# EAGLE design Switch-LIN-SIL-1 (EAGLE 6.5.0)
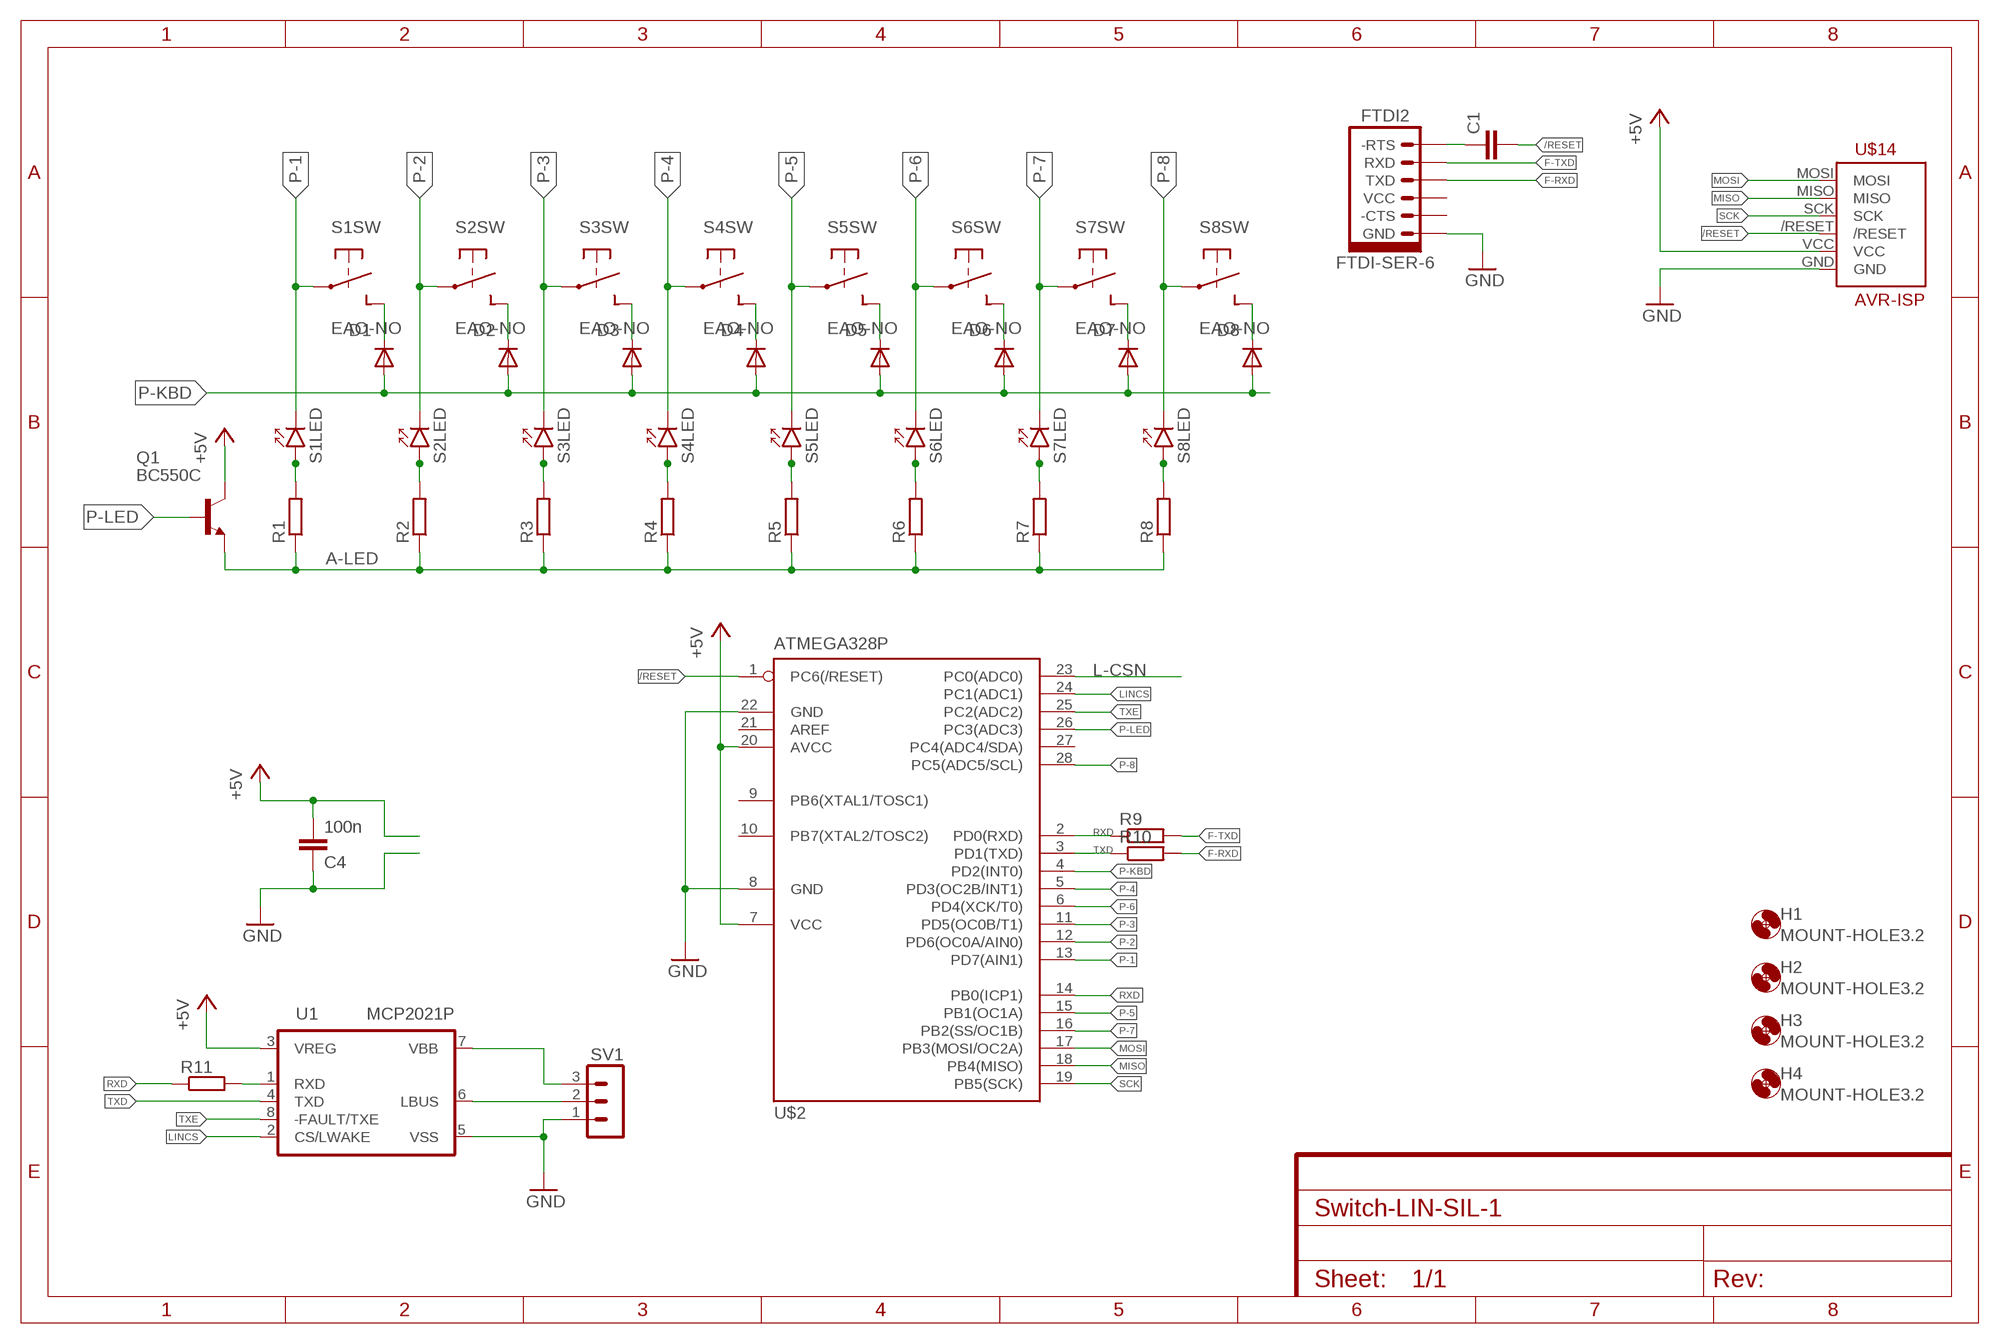
[diagram p0: schematic, sheet 1]

## Parts
C1  C-EU025-025X050  [C025-025X050]
C4  100n  C-EUC0805  [C0805]
D1  1N4148  1N4148DO35-7  [DO35-7]
D2  1N4148  1N4148DO35-7  [DO35-7]
D3  1N4148  1N4148DO35-7  [DO35-7]
D4  1N4148  1N4148DO35-7  [DO35-7]
D5  1N4148  1N4148DO35-7  [DO35-7]
D6  1N4148  1N4148DO35-7  [DO35-7]
D7  1N4148  1N4148DO35-7  [DO35-7]
D8  1N4148  1N4148DO35-7  [DO35-7]
FTDI2  FTDI-SER-6  [FTDI-SER-6]
H1  MOUNT-HOLE3.2  [3,2]
H2  MOUNT-HOLE3.2  [3,2]
H3  MOUNT-HOLE3.2  [3,2]
H4  MOUNT-HOLE3.2  [3,2]
Q1  BC550C  [TO92-EBC]
R1  R-EU_0207/7  [0207/7]
R2  R-EU_0207/7  [0207/7]
R3  R-EU_0207/7  [0207/7]
R4  R-EU_0207/7  [0207/7]
R5  R-EU_0207/7  [0207/7]
R6  R-EU_0207/7  [0207/7]
R7  R-EU_0207/7  [0207/7]
R8  R-EU_0207/7  [0207/7]
R9  R-EU_0207/7  [0207/7]
R10  R-EU_0207/7  [0207/7]
R11  R-EU_0207/7  [0207/7]
S1  EAO-NO  [MA04-1]
S2  EAO-NO  [MA04-1]
S3  EAO-NO  [MA04-1]
S4  EAO-NO  [MA04-1]
S5  EAO-NO  [MA04-1]
S6  EAO-NO  [MA04-1]
S7  EAO-NO  [MA04-1]
S8  EAO-NO  [MA04-1]
SV1  MA03-1  [MA03-1]
U1  MCP2021P  [DIL8]
U$2  ATMEGA328P  [DIL28-3]
U$14  AVR-ISP  [AVR-ISP-SIL]

## Nets
+5V [power]: C4.2 Q1.C U1.3(VREG) U$2.7(VCC) U$2.20(AVCC) U$14.VCC
/RESET: C1.2 U$2.1(PC6(/RESET)) U$14./RESET
A-LED [power]: Q1.E R1.1 R2.1 R3.1 R4.1 R5.1 R6.1 R7.1 R8.1
F-RTS: C1.1 FTDI2.-RTS
F-RXD: FTDI2.TXD R10.2
F-TXD: FTDI2.RXD R9.2
GND [power]: C4.1 FTDI2.GND SV1.1 U1.5(VSS) U$2.8(GND) U$2.22(GND) U$14.GND
L-CSN: U$2.23(PC0(ADC0))
L-RXD: R11.2 U1.1(RXD)
LBUS [l-bus]: SV1.2 U1.6(LBUS)
LINCS: U1.2(CS/LWAKE) U$2.24(PC1(ADC1))
MISO: U$2.18(PB4(MISO)) U$14.MISO
MOSI: U$2.17(PB3(MOSI/OC2A)) U$14.MOSI
N$1: D1.C S1.4(SW:NO2)
N$2: D2.C S2.4(SW:NO2)
N$3: D3.C S3.4(SW:NO2)
N$4: D4.C S4.4(SW:NO2)
N$5: D5.C S5.4(SW:NO2)
N$6: D6.C S6.4(SW:NO2)
N$7: D7.C S7.4(SW:NO2)
N$8: D8.C S8.4(SW:NO2)
N$9: R1.2 S1.2(LED:A)
N$10: R2.2 S2.2(LED:A)
N$11: R3.2 S3.2(LED:A)
N$12: R4.2 S4.2(LED:A)
N$13: R5.2 S5.2(LED:A)
N$14: R6.2 S6.2(LED:A)
N$15: R7.2 S7.2(LED:A)
N$16: R8.2 S8.2(LED:A)
P-1: S1.1(LED:C) S1.3(SW:NO1) U$2.13(PD7(AIN1))
P-2: S2.1(LED:C) S2.3(SW:NO1) U$2.12(PD6(OC0A/AIN0))
P-3: S3.1(LED:C) S3.3(SW:NO1) U$2.11(PD5(OC0B/T1))
P-4: S4.1(LED:C) S4.3(SW:NO1) U$2.5(PD3(OC2B/INT1))
P-5: S5.1(LED:C) S5.3(SW:NO1) U$2.15(PB1(OC1A))
P-6: S6.1(LED:C) S6.3(SW:NO1) U$2.6(PD4(XCK/T0))
P-7: S7.1(LED:C) S7.3(SW:NO1) U$2.16(PB2(SS/OC1B))
P-8: S8.1(LED:C) S8.3(SW:NO1) U$2.28(PC5(ADC5/SCL))
P-KBD: D1.A D2.A D3.A D4.A D5.A D6.A D7.A D8.A U$2.4(PD2(INT0))
P-LED: Q1.B U$2.26(PC3(ADC3))
RXD: R9.1 R11.1 U$2.2(PD0(RXD)) U$2.14(PB0(ICP1))
SCK: U$2.19(PB5(SCK)) U$14.SCK
TXD: R10.1 U1.4(TXD) U$2.3(PD1(TXD))
TXE: U1.8(-FAULT/TXE) U$2.25(PC2(ADC2))
VBB [l-bus]: SV1.3 U1.7(VBB)
Unconnected: FTDI2.-CTS FTDI2.VCC U$2.9(PB6(XTAL1/TOSC1)) U$2.10(PB7(XTAL2/TOSC2)) U$2.21(AREF) U$2.27(PC4(ADC4/SDA))

## Library data of the parts
C1 C4 = rcl:C-EU: CAPACITOR, European symbol
D1-D8 = diode:1N4148: DIODE high speed (Philips)
FTDI2 = alo:FTDI-SER-6: FTDI serial cable header: http://www.ftdichip.com/Products/Cables/USBTTLSerial.htm Models TTL-232R-3V3 and TTL-232R-5V
H1-H4 = holes:MOUNT-HOLE: MOUNTING HOLE with drill center marker
Q1 = transistor-npn:BC550*: NPN Transistor
R1-R11 = rcl:R-EU_: RESISTOR, European symbol
S1-S8 = alo:EAO-NO
SV1 = con-lstb:MA03-1: PIN HEADER; OC_FARNELL: unknown; OC_NEWARK: unknown
U1 = alo:MCP2021
U$2 = alo:ATMEGA328P
U$14 = alo:AVR-ISP

## Net classes
0 default: width 0.305 mm, drill 0.305 mm, clearance 0.152 mm
1 power: width 0.61 mm, drill 0.61 mm, clearance 0.152 mm
2 l-bus: width 0.61 mm, drill 0.61 mm, clearance 0.61 mm

## Board
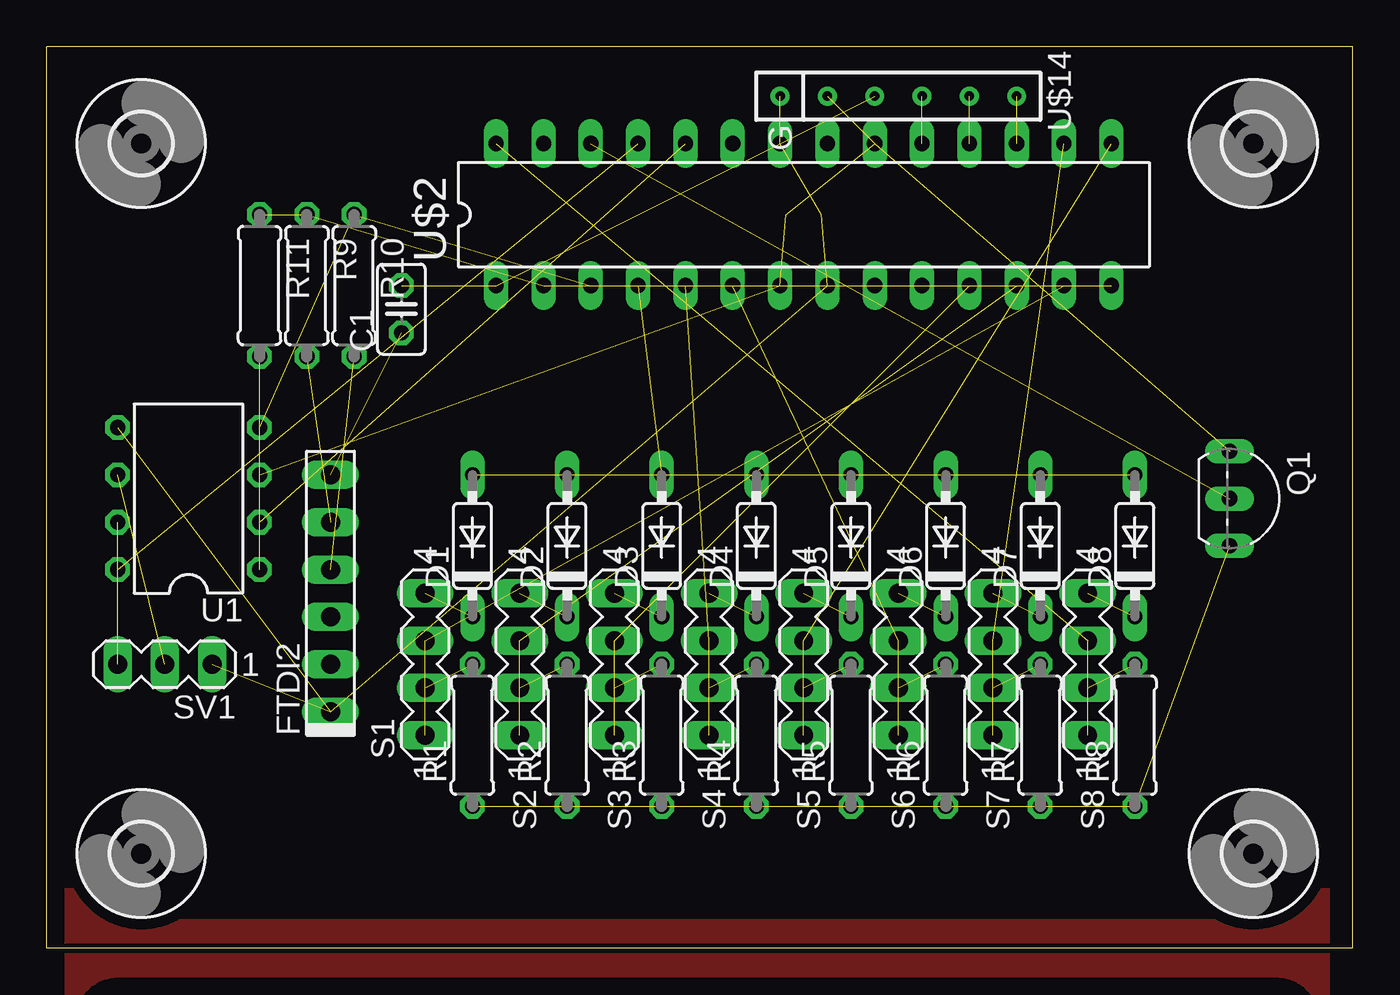
[diagram p1: board, top side]
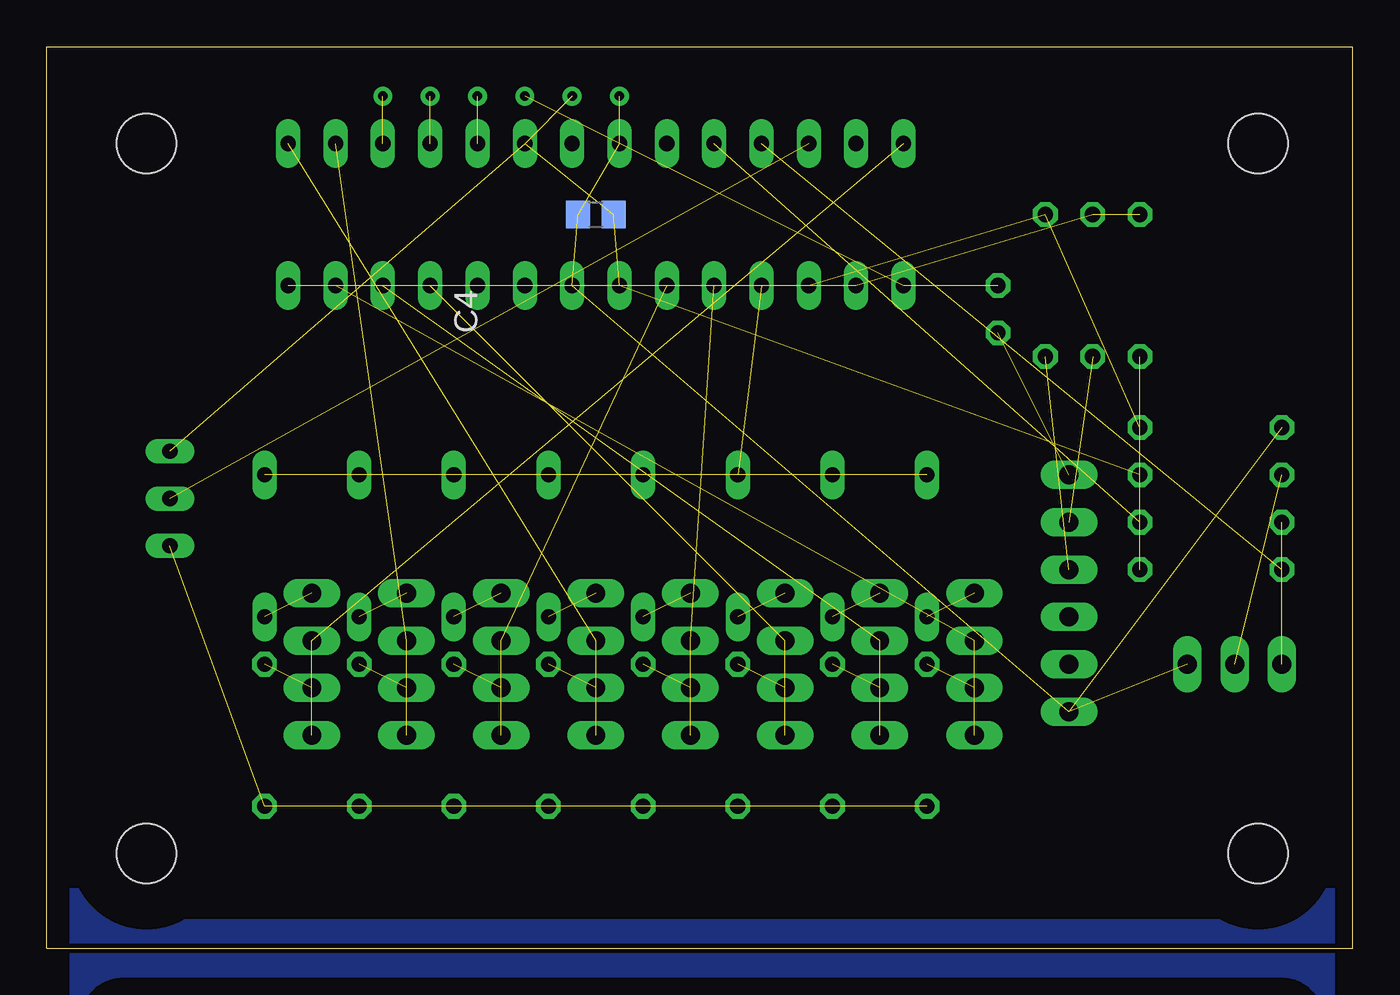
[diagram p2: board, bottom side, seen from below]

Size 70.12 x 48.38 mm. Coordinates in mm from the lower left corner, seen from the top.
Outline: 70.12,0 70.12,48.38 0,48.38 0,0 70.12,0
Copper layers (1*16): Top 0.035mm / dielectric 1.5mm / Bottom 0.035mm
Design rules "seedstudio-octa": minimum track width 6mil, minimum drill 12mil, track to track 6mil, track to pad 6mil, pad to pad 6mil, via to via 6mil, smd to smd 0mil, copper to edge 10mil, drill to drill 10mil, minimum pad ring 10mil, minimum via ring 6mil, stop-mask expansion 2mil, vias tented up to drill 100mil, thermal gap 10mil

### Footprints (pad centres in the part's own frame; a part is rotated, then mirrored left to right if it is on the bottom)
C025-025X050 = drill 0.813 octagon: 1 -1.27,0; 2 1.27,0
C0805 = smd 1.3 x 1.5: 1 -0.95,0; 2 0.95,0
DO35-7 = drill 0.813 long: A 3.81,0; C -3.81,0
FTDI-SER-6 = drill 1.016 long: -CTS -3.81,0; -RTS 6.35,0; GND -6.35,0; RXD 3.81,0; TXD 1.27,0; VCC -1.27,0
3,2 = hole 3.2: 0,0
TO92-EBC = drill 0.813 long: B 0,-1.27; C -2.54,-1.27; E 2.54,-1.27
0207/7 = drill 0.813 octagon: 1 -3.81,0; 2 3.81,0
MA04-1 = drill 1.016 long: 1 -3.81,0; 2 -1.27,0; 3 1.27,0; 4 3.81,0
MA03-1 = drill 1.016 long: 1 -2.54,0; 2 0,0; 3 2.54,0
DIL8 = drill 0.813 octagon: 1 -3.81,-3.81; 2 -1.27,-3.81; 3 1.27,-3.81; 4 3.81,-3.81; 5 3.81,3.81; 6 1.27,3.81; 7 -1.27,3.81; 8 -3.81,3.81
DIL28-3 = drill 0.813 long: 1 -16.51,-3.81; 2 -13.97,-3.81; 3 -11.43,-3.81; 4 -8.89,-3.81; 5 -6.35,-3.81; 6 -3.81,-3.81; 7 -1.27,-3.81; 8 1.27,-3.81; 9 3.81,-3.81; 10 6.35,-3.81; 11 8.89,-3.81; 12 11.43,-3.81; 13 13.97,-3.81; 14 16.51,-3.81; 15 16.51,3.81; 16 13.97,3.81; 17 11.43,3.81; 18 8.89,3.81; 19 6.35,3.81; 20 3.81,3.81; 21 1.27,3.81; 22 -1.27,3.81; 23 -3.81,3.81; 24 -6.35,3.81; 25 -8.89,3.81; 26 -11.43,3.81; 27 -13.97,3.81; 28 -16.51,3.81
AVR-ISP-SIL = drill 0.508: /RESET 0,-1.27; GND 0,-6.35; MISO 0,3.81; MOSI 0,6.35; SCK 0,1.27; VCC 0,-3.81

### Placement (x,y rotation side)
C1  19.05,34.29 90 top
C4  40.64,39.37 0 bottom
D1  22.86,21.59 90 top
D2  27.94,21.59 90 top
D3  33.02,21.59 90 top
D4  38.1,21.59 90 top
D5  43.18,21.59 90 top
D6  48.26,21.59 90 top
D7  53.34,21.59 90 top
D8  58.42,21.59 90 top
FTDI2  15.24,19.05 90 top
H1  5.08,43.18 0 top
H2  5.08,5.08 0 top
H3  64.77,5.08 0 top
H4  64.77,43.18 0 top
Q1  64.77,24.13 270 top
R1  22.86,11.43 90 top
R2  27.94,11.43 90 top
R3  33.02,11.43 90 top
R4  38.1,11.43 90 top
R5  43.18,11.43 90 top
R6  48.26,11.43 90 top
R7  53.34,11.43 90 top
R8  58.42,11.43 90 top
R9  13.97,35.56 270 top
R10  16.51,35.56 270 top
R11  11.43,35.56 270 top
S1  20.32,15.24 90 top
S2  25.4,15.24 90 top
S3  30.48,15.24 90 top
S4  35.56,15.24 90 top
S5  40.64,15.24 90 top
S6  45.72,15.24 90 top
S7  50.8,15.24 90 top
S8  55.88,15.24 90 top
SV1  6.35,15.24 180 top
U1  7.62,24.13 90 top
U$2  40.64,39.37 0 top
U$14  45.72,45.72 270 top

### Tracks (layer width: path | path; a pad name or v marks a point on that pad's centre or on a via)
+5V  (5 unrouted)
  pour Top: 68.58,-3.81 68.58,3.81 arc-90 66.04,1.27 3.81,1.27 arc-90 1.27,3.81 1.27,-3.81 arc-90 3.81,-1.27 66.04,-1.27 arc-90
/RESET  (2 unrouted)
A-LED  (8 unrouted)
F-RTS  (1 unrouted)
F-RXD  (1 unrouted)
F-TXD  (1 unrouted)
GND  (6 unrouted)
  pour Bottom: 68.58,-3.81 68.58,3.81 arc-90 66.04,1.27 3.81,1.27 arc-90 1.27,3.81 1.27,-3.81 arc-90 3.81,-1.27 66.04,-1.27 arc-90
L-RXD  (1 unrouted)
LBUS  (1 unrouted)
LINCS  (1 unrouted)
MISO  (1 unrouted)
MOSI  (1 unrouted)
N$1  (1 unrouted)
N$2  (1 unrouted)
N$3  (1 unrouted)
N$4  (1 unrouted)
N$5  (1 unrouted)
N$6  (1 unrouted)
N$7  (1 unrouted)
N$8  (1 unrouted)
N$9  (1 unrouted)
N$10  (1 unrouted)
N$11  (1 unrouted)
N$12  (1 unrouted)
N$13  (1 unrouted)
N$14  (1 unrouted)
N$15  (1 unrouted)
N$16  (1 unrouted)
P-1  (2 unrouted)
P-2  (2 unrouted)
P-3  (2 unrouted)
P-4  (2 unrouted)
P-5  (2 unrouted)
P-6  (2 unrouted)
P-7  (2 unrouted)
P-8  (2 unrouted)
P-KBD  (8 unrouted)
P-LED  (1 unrouted)
RXD  (3 unrouted)
SCK  (1 unrouted)
TXD  (2 unrouted)
TXE  (1 unrouted)
VBB  (1 unrouted)